# Altium schematic sheet test2235.SchDoc
size A4
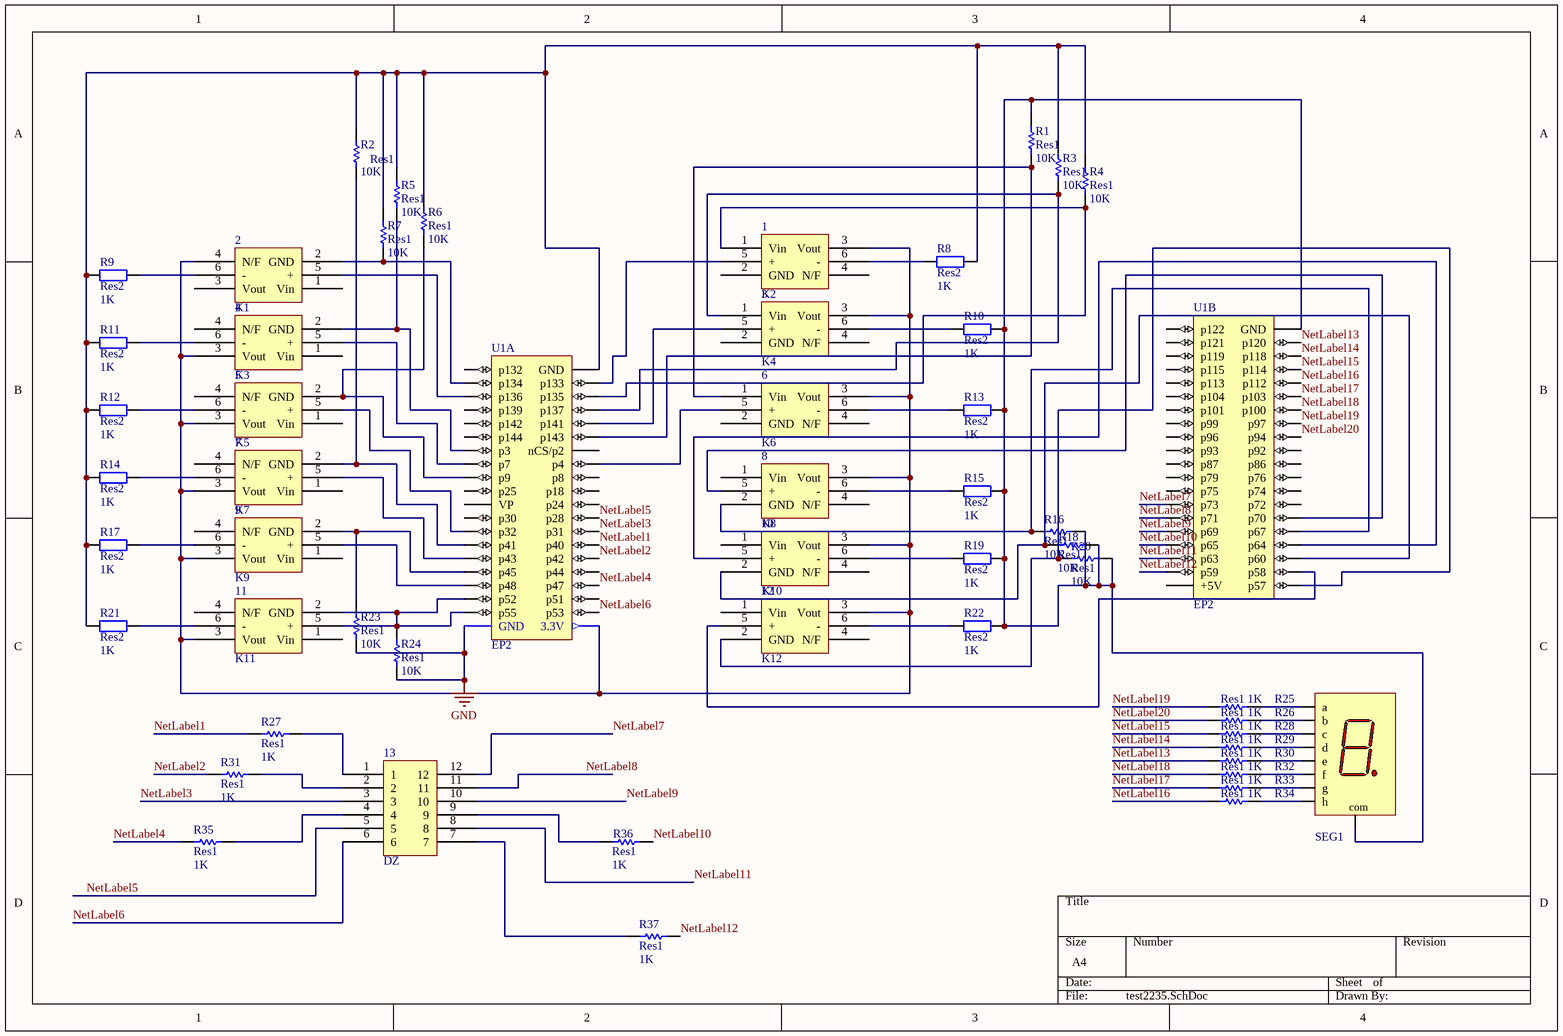
[diagram p0: test2235.SchDoc]

## Parts
1  K2  [KG]
2  K1  [KG]
3  K4  [KG]
4  K3  [KG]
5  K5  [KG]
6  K6  [KG]
7  K7  [KG]
8  K8  [KG]
9  K9  [KG]
10  K10  [KG]
11  K11  [KG]
12  K12  [KG]
13  DZ  [DZ]
R1  Res1  value 10K  [AXIAL-0.3]
R2  Res1  value 10K  [AXIAL-0.3]
R3  Res1  value 10K  [AXIAL-0.3]
R4  Res1  value 10K  [AXIAL-0.3]
R5  Res1  value 10K  [AXIAL-0.3]
R6  Res1  value 10K  [AXIAL-0.3]
R7  Res1  value 10K  [AXIAL-0.3]
R8  Res2  value 1K  [AXIAL-0.4]
R9  Res2  value 1K  [AXIAL-0.4]
R10  Res2  value 1K  [AXIAL-0.4]
R11  Res2  value 1K  [AXIAL-0.4]
R12  Res2  value 1K  [AXIAL-0.4]
R13  Res2  value 1K  [AXIAL-0.4]
R14  Res2  value 1K  [AXIAL-0.4]
R15  Res2  value 1K  [AXIAL-0.4]
R16  Res1  value 10K  [AXIAL-0.3]
R17  Res2  value 1K  [AXIAL-0.4]
R18  Res1  value 10K  [AXIAL-0.3]
R19  Res2  value 1K  [AXIAL-0.4]
R20  Res1  value 10K  [AXIAL-0.3]
R21  Res2  value 1K  [AXIAL-0.4]
R22  Res2  value 1K  [AXIAL-0.4]
R23  Res1  value 10K  [AXIAL-0.3]
R24  Res1  value 10K  [AXIAL-0.3]
R25  Res1  value 1K  [AXIAL-0.3]
R26  Res1  value 1K  [AXIAL-0.3]
R27  Res1  value 1K  [AXIAL-0.3]
R28  Res1  value 1K  [AXIAL-0.3]
R29  Res1  value 1K  [AXIAL-0.3]
R30  Res1  value 1K  [AXIAL-0.3]
R31  Res1  value 1K  [AXIAL-0.3]
R32  Res1  value 1K  [AXIAL-0.3]
R33  Res1  value 1K  [AXIAL-0.3]
R34  Res1  value 1K  [AXIAL-0.3]
R35  Res1  value 1K  [AXIAL-0.3]
R36  Res1  value 1K  [AXIAL-0.3]
R37  Res1  value 1K  [AXIAL-0.3]
SEG1  Displayer-SEG-7  [QH5011AS]  (value not drawn)
U1  EP2  [EP2-TQFP144]  (parts A,B of 2)

## Nets
GND: R23.1 R24.1 U1.79(GND)
NetLabel1: R27.2 U1.25(p40)
NetLabel2: R31.2 U1.24(p42)
NetLabel3: 13.3 U1.26(p31)
NetLabel4: R35.2 U1.22(p47)
NetLabel5: 13.5 U1.27(p28)
NetLabel6: 13.6 U1.20(p53)
NetLabel7: 13.12 U1.52(p73)
NetLabel8: 13.11 U1.53(p71)
NetLabel9: 13.10 U1.54(p69)
NetLabel10: R36.1 U1.55(p65)
NetLabel11: 13.8 U1.56(p63)
NetLabel12: R37.1 U1.57(p59)
NetLabel13: R30.1 U1.77(p120)
NetLabel14: R29.1 U1.76(p118)
NetLabel15: R28.1 U1.75(p114)
NetLabel16: R34.1 U1.74(p112)
NetLabel17: R33.1 U1.73(p103)
NetLabel18: R32.1 U1.72(p100)
NetLabel19: R25.1 U1.71(p97)
NetLabel20: R26.1 U1.70(p94)
Net1_1: 1.1(Vin) R4.1 U1.36(p135)
Net1_3: 1.3(Vout) 2.4(N/F) 3.3(Vout) 4.3(Vout) 5.3(Vout) 6.3(Vout) 7.3(Vout) 8.3(Vout) 9.3(Vout) 10.3(Vout) 11.3(Vout) 12.3(Vout) U1.80(3.3V)
Net1_5: 1.5(+) U1.37(p133)
Net1_6: 1.6(-) R8.1
Net2_2: 2.2(GND) R7.1 U1.2(p134)
Net2_5: 2.5(+) U1.3(p136)
Net2_6: 2.6(-) R9.2
Net3_1: 3.1(Vin) R3.1 U1.35(p137)
Net3_5: 3.5(+) U1.34(p141)
Net3_6: 3.6(-) R10.1
Net4_2: 4.2(GND) R5.1 U1.7(p3)
Net4_5: 4.5(+) U1.8(p7)
Net4_6: 4.6(-) R11.2
Net5_2: 5.2(GND) R6.1 U1.9(p9)
Net5_5: 5.5(+) U1.13(p32)
Net5_6: 5.6(-) R12.2
Net6_1: 6.1(Vin) R1.1 U1.33(p143)
Net6_5: 6.5(+) U1.31(p4)
Net6_6: 6.6(-) R13.1
Net7_2: 7.2(GND) R2.1 U1.14(p41)
Net7_5: 7.5(+) U1.15(p43)
Net7_6: 7.6(-) R14.2
Net8_2: 8.2(GND) R16.1 U1.63(p67)
Net8_5: 8.5(+) U1.64(p70)
Net8_6: 8.6(-) R15.1
Net9_2: 9.2(GND) R23.2 U1.16(p45)
Net9_5: 9.5(+) U1.17(p48)
Net9_6: 9.6(-) R17.2
Net10_2: 10.2(GND) R18.1 U1.61(p60)
Net10_5: 10.5(+) U1.62(p64)
Net10_6: 10.6(-) R19.1
Net11_2: 11.2(GND) 11.5(+) R24.2 U1.18(p52) U1.19(p55)
Net11_6: 11.6(-) R21.2
Net12_2: 12.2(GND) R20.1 U1.59(p57)
Net12_5: 12.5(+) U1.60(p58)
Net12_6: 12.6(-) R22.1
Net13_1: 13.1 R27.1
Net13_2: 13.2 R31.1
Net13_4: 13.4 R35.1
Net13_7: 13.7 R37.2
Net13_9: 13.9 R36.2
NetR1_2: R1.2 R10.2 R13.2 R15.2 R16.2 R18.2 R19.2 R20.2 R22.2 SEG1.com U1.78(GND)
NetR2_2: R2.2 R3.2 R4.2 R5.2 R6.2 R7.2 R8.2 R9.1 R11.1 R12.1 R14.1 R17.1 R21.1 U1.38(GND)
NetR25_2: R25.2 SEG1.a
NetR26_2: R26.2 SEG1.b
NetR28_2: R28.2 SEG1.c
NetR29_2: R29.2 SEG1.d
NetR30_2: R30.2 SEG1.e
NetR32_2: R32.2 SEG1.f
NetR33_2: R33.2 SEG1.g
NetR34_2: R34.2 SEG1.h

Not connected (* = marked no-connect by the designer): 1 2(GND) 4(N/F); 2 1(Vin) 3(Vout); 3 2(GND) 4(N/F); 4 1(Vin) 4(N/F); 5 1(Vin) 4(N/F); 6 2(GND) 4(N/F); 7 1(Vin) 4(N/F); 8 1(Vin) 4(N/F); 9 1(Vin) 4(N/F); 10 1(Vin) 4(N/F); 11 1(Vin) 4(N/F); 12 1(Vin) 4(N/F); U1 1(p132) 4(p139) 5(p142) 6(p144) 10(p25) 11(VP) 12(p30) 21(p51) 23(p44) 28(p24) 29(p18) 30(p8) 32(nCS/p2) 39(p122) 40(p121) 41(p119) 42(p115) 43(p113) 44(p104) 45(p101) 46(p99) 47(p96) 48(p93) 49(p87) 50(p79) 51(p75) 58(+5V) 65(p72) 66(p74) 67(p76) 68(p86) 69(p92)

## Library data of the parts
1-12 = Component_1
R1-R7 R16 R18 R20 R23-R37 = Res1: Resistor; Published: 8-Jun-2000; LatestRevisionDate: 17-Jul-2002; LatestRevisionNote: Re-released for DXP Platform.; PackageReference: AXIAL-0.3; Publisher: Altium Limited; PackageDescription: Axial Device, Thru-Hole; 2 Leads; 0.3 in Pin Spacing
R8-R15 R17 R19 R21 R22 = Res2: Resistor; Published: 8-Jun-2000; LatestRevisionDate: 17-Jul-2002; LatestRevisionNote: Re-released for DXP Platform.; PackageReference: AXIAL-0.4; Publisher: Altium Limited; PackageDescription: Axial Device, Thru-Hole; 2 Leads; 0.4 in Pin Spacing
SEG1 = Displayer-SEG-7: 七段数码管
U1 = EP2: 适用于连接西南交大电子学实验室的MFB5上用的FPGA小板